# EAGLE design MyMultisensors_rev1 (EAGLE 6.5.0)
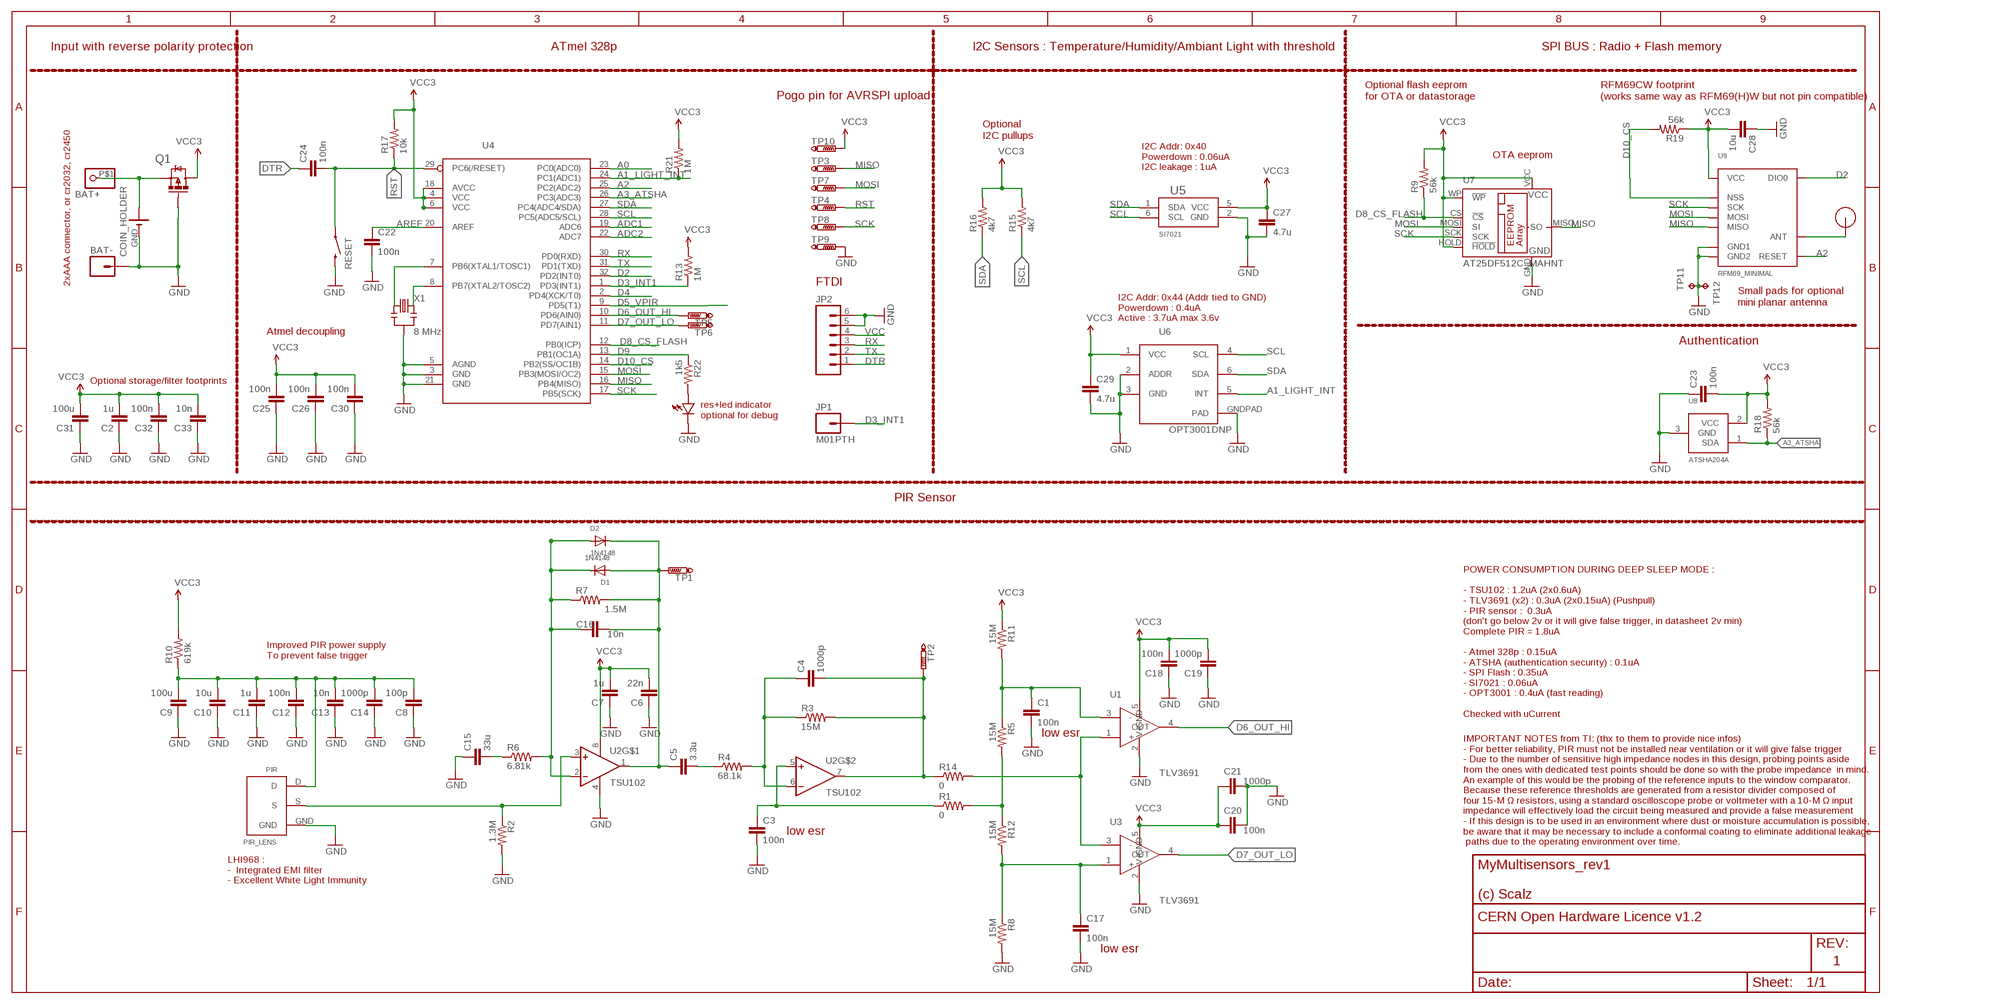
[diagram p0: schematic, sheet 1]

## Parts
ANT  RFM12B_ANTENNA  [RFM12B-ANTENNA]
BAT+  PINHD-1X1TOP  [1X01_ONESIDE]
BAT-  M01PTH  [1X01]
C1  100n  CAP0603-CAP  [0603-CAP]
C2  1u  CAP0805-CAP  [0805-CAP]
C3  100n  CAP0603-CAP  [0603-CAP]
C4  1000p  CAP0603-CAP  [0603-CAP]
C5  3.3u  CAP0603-CAP  [0603-CAP]
C6  22n  CAP0603-CAP  [0603-CAP]
C7  1u  CAP0603-CAP  [0603-CAP]
C8  100p  CAP0603-CAP  [0603-CAP]
C9  100u  CAP0805-CAP  [0805-CAP]
C10  10u  CAP0805-CAP  [0805-CAP]
C11  1u  CAP0603-CAP  [0603-CAP]
C12  100n  CAP0603-CAP  [0603-CAP]
C13  10n  CAP0603-CAP  [0603-CAP]
C14  1000p  CAP0603-CAP  [0603-CAP]
C15  33u  CAP0805-CAP  [0805-CAP]
C16  10n  CAP0603-CAP  [0603-CAP]
C17  100n  CAP0603-CAP  [0603-CAP]
C18  100n  CAP0603-CAP  [0603-CAP]
C19  1000p  CAP0603-CAP  [0603-CAP]
C20  100n  CAP0603-CAP  [0603-CAP]
C21  1000p  CAP0603-CAP  [0603-CAP]
C22  100n  CAP0603-CAP  [0603-CAP]
C23  100n  CAP0603-CAP  [0603-CAP]
C24  100n  CAP0805-CAP  [0805-CAP]
C25  100n  CAP0603-CAP  [0603-CAP]
C26  100n  CAP0603-CAP  [0603-CAP]
C27  4.7u  CAP0603-CAP  [0603-CAP]
C28  10u  CAP0805-CAP  [0805-CAP]
C29  4.7u  CAP0603-CAP  [0603-CAP]
C30  100n  CAP0603-CAP  [0603-CAP]
C31  100u  CAP0805-CAP  [0805-CAP]
C32  100n  CAP0603-CAP  [0603-CAP]
C33  10n  CAP0603-CAP  [0603-CAP]
COIN_HOLDER  CR2450_H_LOWCOSTVERTICAL_WITH_MILL  [CR2450H_LOWCOST2]
D1  1N4148  DIODESOD-123  [SOD-123]
D2  1N4148  DIODESOD-123  [SOD-123]
D3  LED0805  [0805-LED]
JP1  M01PTH  [1X01]
JP2  M06SIP  [1X06]
PIR  PIR_LENS  [PIR_LENS]
Q1  SI2399DS-T1-GE3  [SOT95P237X112-3N]
R1  0  RESISTOR0603-RES  [0603-RES]
R2  1.3M  RESISTOR0603-RES  [0603-RES]
R3  15M  RESISTOR0603-RES  [0603-RES]
R4  68.1k  RESISTOR0603-RES  [0603-RES]
R5  15M  RESISTOR0603-RES  [0603-RES]
R6  6.81k  RESISTOR0603-RES  [0603-RES]
R7  1.5M  RESISTOR0603-RES  [0603-RES]
R8  15M  RESISTOR0603-RES  [0603-RES]
R9  56k  RESISTOR0603-RES  [0603-RES]
R10  619k  RESISTOR0603-RES  [0603-RES]
R11  15M  RESISTOR0603-RES  [0603-RES]
R12  15M  RESISTOR0603-RES  [0603-RES]
R13  1M  RESISTOR0603-RES  [0603-RES]
R14  0  RESISTOR0603-RES  [0603-RES]
R15  4k7  RESISTOR0603-RES  [0603-RES]
R16  4k7  RESISTOR0603-RES  [0603-RES]
R17  10k  RESISTOR0805-RES  [0805-RES]
R18  56k  RESISTOR0603-RES  [0603-RES]
R19  56k  RESISTOR0603-RES  [0603-RES]
R21  1M  RESISTOR0603-RES  [0603-RES]
R22  1k5  RESISTOR0603-RES  [0603-RES]
RESET  SWITCH-MOMENTARY-2-SMD-1101NE  [TACTILE-SWITCH-1101NE]
TP1  PTR1B1,27  [B1,27]
TP2  PTR1B1,27  [B1,27]
TP3  PTR1TP18R  [TP18R]
TP4  PTR1TP18R  [TP18R]
TP5  PTR1B1,27  [B1,27]
TP6  PTR1B1,27  [B1,27]
TP7  PTR1TP18R  [TP18R]
TP8  PTR1TP18R  [TP18R]
TP9  PTR1TP18R  [TP18R]
TP10  PTR1TP18R  [TP18R]
TP11  TPTP10SQ  [TP10SQ]
TP12  TPTP10SQ  [TP10SQ]
U1  TLV3691  [SC70-5]
U2  TSU102  [MINI_SO8]
U3  TLV3691  [SC70-5]
U4  ATMega-328  ATMEGA168/328TQFP32  [TQFP32-08]
U5  SI7021  [DFN6]
U6  OPT3001DNP  [OPT3001DNP]
U7  AT25DF512C_MAHNT  [AT25DF512C_MAHNT]
U8  ATSHA204A  [SOT23]
U9  RFM69_MINIMAL  [RFM69CW_MINIMAL]
X1  8 MHz  RESONATORSMD  [RESONATOR-SMD]

## Nets
A0: U4.23(PC0(ADC0))
A1_LIGHT_INT: R21.1 U4.24(PC1(ADC1)) U6.5(INT)
A2: U4.25(PC2(ADC2)) U9.RESET
A3_ATSHA: R18.1 U4.26(PC3(ADC3)) U8.1(SDA)
ADC1: U4.19(ADC6)
ADC2: U4.22(ADC7)
AREF: C22.1 U4.20(AREF)
D2: U4.32(PD2(INT0)) U9.DIO0
D3_INT1: JP1.1 R13.1 U4.1(PD3(INT1))
D4: U4.2(PD4(XCK/T0))
D5_VPIR: U4.9(PD5(T1))
D6_OUT_HI: TP5.TP U1.4(OUT) U4.10(PD6(AIN0))
D7_OUT_LO: TP6.TP U3.4(OUT) U4.11(PD7(AIN1))
D8_CS_FLASH: R9.1 U4.12(PB0(ICP)) U7.CS(!CS)
D9: R22.1 U4.13(PB1(OC1A))
D10_CS: R19.2 U4.14(PB2(SS/OC1B)) U9.NSS
DTR: C24.1 JP2.1
GND: BAT-.1 C1.2 C2.1 C3.2 C6.1 C7.1 C8.1 C9.1 C10.1 C11.1 C12.1 C13.1 C14.1 C15.1 C17.2 C18.1 C19.1 C20.1 C21.1 C22.2 C23.1 C25.1 C26.1 C27.2 C28.1 C29.2 C30.1 C31.1 C32.1 C33.1 COIN_HOLDER.GND(-) D3.MINUS JP2.5 JP2.6 PIR.GND Q1.1(G) R2.2 R8.2 RESET.P$2 TP9.TP TP11.TP TP12.TP U1.2(GND) U2.4(V-) U3.2(GND) U4.3(GND) U4.5(AGND) U4.21(GND) U5.2(GND) U6.2(ADDR) U6.3(GND) U6.GNDPAD(PAD) U7.GND U8.3(GND) U9.GND2 U9.GND(GND1) X1.2
MISO: TP3.TP U4.16(PB4(MISO)) U7.MISO(SO) U9.MISO
MOSI: TP7.TP U4.15(PB3(MOSI/OC2)) U7.MOSI(SI) U9.MOSI
N$1: C17.1 R8.1 R12.2 U3.1(+)
N$3: PIR.S R2.1 U2.3(+IN)
N$4: D3.PLUS R22.2
N$5: C16.1 D1.C D2.A R6.2 R7.1 U2.2(-IN)
N$6: C15.2 R6.1
N$7: C5.1 C16.2 D1.A D2.C R7.2 TP1.TP U2.1(OUT)
N$8: C5.2 R4.1
N$9: C4.1 R3.1 R4.2 U2.6(-IN)
N$10: C4.2 R3.2 R14.1 TP2.TP U2.7(OUT)
N$11: U4.7(PB6(XTAL1/TOSC1)) X1.1
N$13: C1.1 R5.1 R11.2 U1.3(-)
N$17: C3.1 R1.1 U2.5(+IN)
N$18: C8.2 C9.2 C10.2 C11.2 C12.2 C13.2 C14.2 PIR.D R10.1
N$20: R14.2 U1.1(+) U3.3(-)
N$21: R1.2 R5.2 R12.1
N$22: U4.8(PB7(XTAL2/TOSC2)) X1.3
N$23: ANT.P$1 U9.ANT
N$24: BAT+.P$1 COIN_HOLDER.VBAT@1(+) COIN_HOLDER.VBAT@2(+) COIN_HOLDER.VBAT@3(+) COIN_HOLDER.VBAT@4(+) Q1.2(S)
RST: C24.2 R17.1 RESET.P$1 TP4.TP U4.29(PC6(/RESET))
RX: JP2.3 U4.30(PD0(RXD))
SCK: TP8.TP U4.17(PB5(SCK)) U7.SCK U9.SCK
SCL: R15.1 U4.28(PC5(ADC5/SCL)) U5.6(SCL) U6.4(SCL)
SDA: R16.1 U4.27(PC4(ADC4/SDA)) U5.1(SDA) U6.6(SDA)
TX: JP2.2 U4.31(PD1(TXD))
VCC: C2.2 C6.2 C7.2 C18.2 C19.2 C20.2 C21.2 C23.2 C25.2 C26.2 C27.1 C28.2 C29.1 C30.2 C31.2 C32.2 C33.2 JP2.4 Q1.3(D) R9.2 R10.2 R11.1 R13.2 R15.2 R16.2 R17.2 R18.2 R19.1 R21.2 TP10.TP U1.5(V+) U2.8(V+) U3.5(V+) U4.4(VCC) U4.6(VCC) U4.18(AVCC) U5.5(VCC) U6.1(VCC) U7.HOLD(!HOLD) U7.VCC U7.WP(!WP) U8.2(VCC) U9.VDD(VCC) ; supply symbol labelled VCC3

## Notes on the sheet
- Input with reverse polarity protection | ATmel 328p | I2C Sensors : Temperature/Humidity/Ambiant Light with threshold | SPI BUS : Radio + Flash memory
- Pogo pin for AVRSPI upload
- Optional flash eeprom
  for OTA or datastorage
- RFM69CW footprint 
  (works same way as RFM69(H)W but not pin compatible)
- Optional 
  I2C pullups
- OTA eeprom
- I2C Addr: 0x40
  Powerdown : 0.06uA
  I2C leakage : 1uA
- 2xAAA connector, or cr2032, cr2450 | FTDI
- Small pads for optional
  mini planar antenna
- I2C Addr: 0x44 (Addr tied to GND)
  Powerdown : 0.4uA
  Active : 3.7uA max 3.6v
- Atmel decoupling
- Authentication
- Optional storage/filter footprints
- res+led indicator
  optional for debug
- PIR Sensor
- Improved PIR power supply
  To prevent false trigger
- POWER CONSUMPTION DURING DEEP SLEEP MODE :
  
  - TSU102 : 1.2uA (2x0.6uA)
  - TLV3691 (x2) : 0.3uA (2x0.15uA) (Pushpull)
  - PIR sensor :  0.3uA
  (don't go below 2v or it will give false trigger, in datasheet 2v min) 
  Complete PIR = 1.8uA 
  
  - Atmel 328p : 0.15uA
  - ATSHA (authentication security) : 0.1uA
  - SPI Flash : 0.35uA
  - SI7021 : 0.06uA
  - OPT3001 : 0.4uA (fast reading)
  
  Checked with uCurrent
- low esr
- low esr
- IMPORTANT NOTES from TI: (thx to them to provide nice infos)
  - For better reliability, PIR must not be installed near ventilation or it will give false trigger
  - Due to the number of sensitive high impedance nodes in this design, probing points aside 
  from the ones with dedicated test points should be done so with the probe impedance  in mind. 
  An example of this would be the probing of the reference inputs to the window comparator. 
  Because these reference thresholds are generated from a resistor divider composed of 
  four 15-M Ω resistors, using a standard oscilloscope probe or voltmeter with a 10-M Ω input 
  impedance will effectively load the circuit being measured and provide a false measurement
  - If this design is to be used in an environment where dust or moisture accumulation is possible,
  be aware that it may be necessary to include a conformal coating to eliminate additional leakage 
   paths due to the operating environment over time.
- LHI968 :
  -  Integrated EMI filter
  - Excellent White Light Immunity
- low esr

## Library data of the parts
ANT = LowPowerLab:RFM12B_ANTENNA
BAT+ = Multisensors_lib:PINHD-1X1: Pin header 1x1 for 0.1" spacing With round pins
BAT- JP1 = SparkFun-Connectors:M01: Header 1 Standard 1-pin 0.1" header. Use with straight break away headers (SKU : PRT-00116), right angle break away headers (PRT-00553), swiss pins (PRT-00743), machine pins (PRT-00117), and female headers (PRT-00115).
C1-C33 = LowPowerLab:CAP: Capacitor Standard 0603 ceramic capacitor, and 0.1" leaded capacitor.
COIN_HOLDER = Multisensors_lib:CR2450_H_LOWCOST
D1 D2 = adafruit:DIODE: Diode SMADIODE - SMA Surface Mount Package 20V 1A Schottky Diode Digikey: 641-1014-6-ND DO-1N4148 - Through Hole Small Current Diode SOD-123 20V 1 A (.5mV Vf) Schottky Diode - Digikey: MBRX120TPMSCT-ND SOD-323 10V 570mA (.38mV Vf, 3ns) Schottky Diode - Digikey: ZLLS410CT-ND SOD-523 30V 30mA Schottky Diode (RB751S-40TE61) - Digikey: RB751S-40TE61CT-ND SOT23-R/W - SOT23 Package (R = Solder Paste/Reflow Ovens, W = Hand-Soldering) BAT54Film 40V 300mA - Digikey: 497-7162-1-ND
D3 = LowPowerLab:LED
JP2 = SparkFun-Connectors:M06: Header 6 Standard 6-pin 0.1" header. Use with straight break away headers (SKU : PRT-00116), right angle break away headers (PRT-00553), swiss pins (PRT-00743), machine pins (PRT-00117), and female headers (PRT-00115). Molex polarized connector foot print use with SKU : PRT-08094 with associated crimp pins and housings. NOTES ON THE VARIANTS LOCK and LOCK_LONGPADS... This footprint was designed to help hold the alignment of a through-hole component (i.e. 6-pin header) while soldering it into place. You may notice that each hole has been shifted either up or down by 0.005 of an inch from it's more standard position (which is a perfectly straight line). This slight alteration caused the pins (the squares in the middle) to touch the edges of the holes. Because they are alternating, it causes a "brace" to hold the component in place. 0.005 has proven to be the perfect amount of "off-center" position when using our standard breakaway headers. Although looks a little odd when you look at the bare footprint, once you have a header in there, the alteration is very hard to notice. Also,if you push a header all the way into place, it is covered up entirely on the bottom side. This idea of altering the position of holes to aid alignment will be further integrated into the Sparkfun Library for other footprints. It can help hold any component with 3 or more connection pins.
PIR = Multisensors_lib:PIR_LENS
Q1 = Multisensors_lib:SI2399DS-T1-GE3: P-Channel 20-V (D-S) MOSFET; MPN: SI2399DS-T1-GE3; OC_FARNELL: 2056681; OC_NEWARK: 64T4058; PACKAGE: SOT-23-3; SUPPLIER: VISHAY SILICONIX
R1-R19 R21 R22 = LowPowerLab:RESISTOR: Resistor Basic schematic elements and footprints for 0603, 1206, and PTH resistors.
RESET = SparkFun:SWITCH-MOMENTARY-2
TP1-TP10 = testpad:PTR1: TEST PIN
TP11 TP12 = testpad:TP: Test pad
U1 U3 = Multisensors_lib:TLV3691
U2 = Multisensors_lib:TSU102
U4 = LowPowerLab:ATMEGA168/328: Atmel 32-pin 8-bit micro, 16k flash.
U5 = Multisensors_lib:SI7021
U6 = Multisensors_lib:OPT3001DNP
U7 = Multisensors_lib:AT25DF512C_MAHNT
U8 = Multisensors_lib:ATSHA204A
U9 = Multisensors_lib:RFM69_MINIMAL
X1 = SparkFun:RESONATOR: Resonator Small SMD resonator. This is the itty bitty 10/20MHz resonators with built in caps. CSTCE10M0G55 and CSTCE20M0V53. Footprint has been reviewed closely but hasn't been tested yet.

## Net classes
0 default: width 0.203 mm, clearance 0.203 mm

## Board
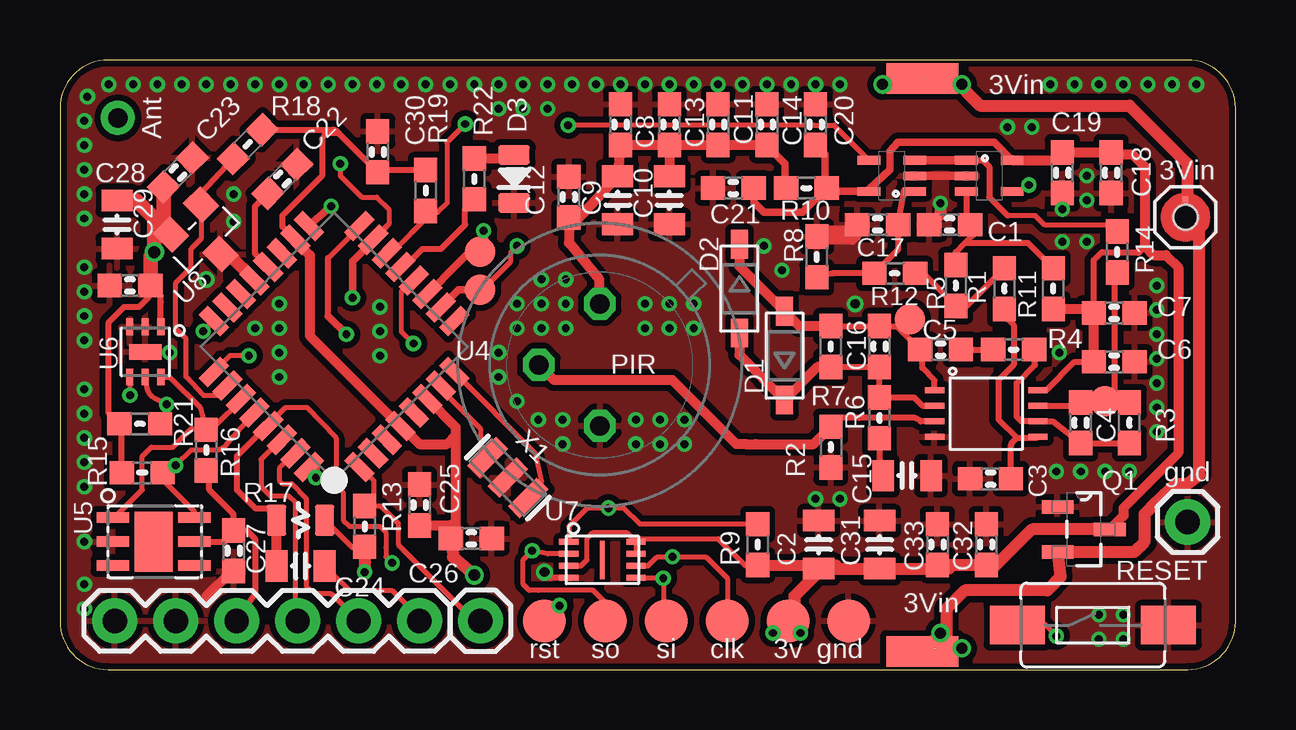
[diagram p1: board, top side]
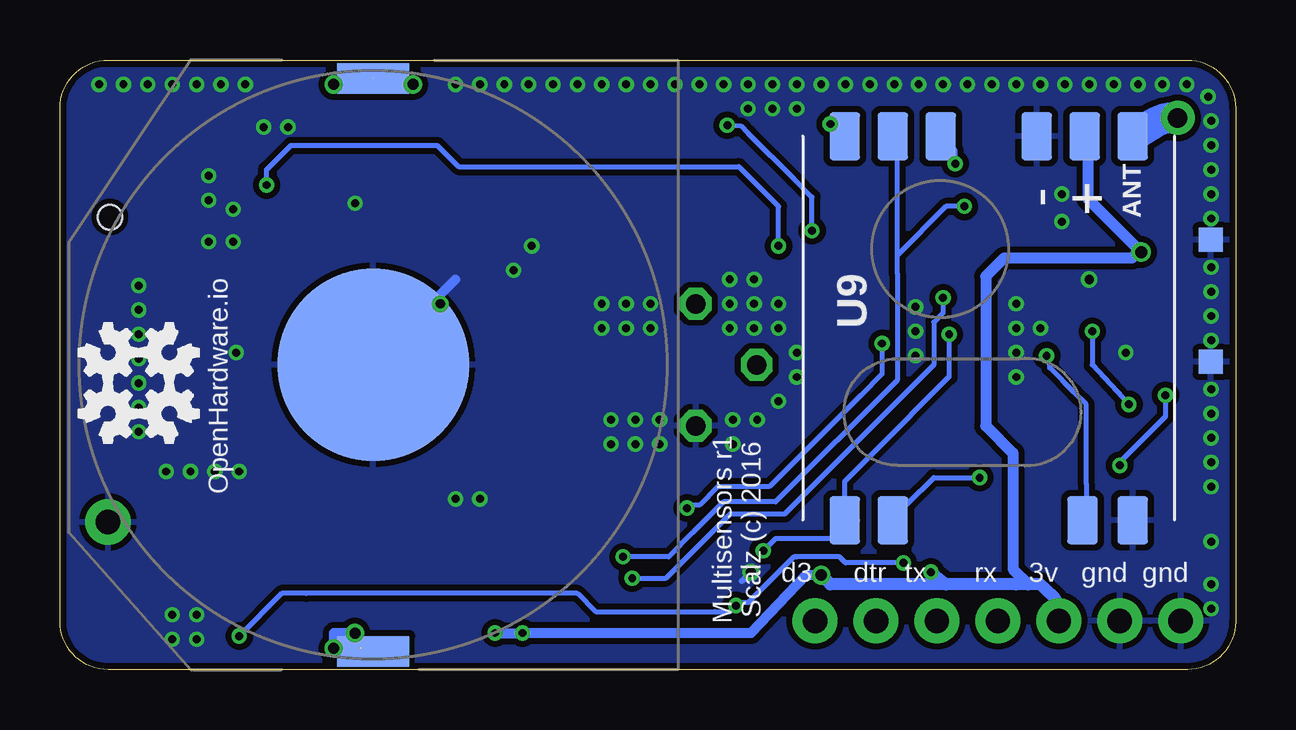
[diagram p2: board, bottom side, seen from below]

Size 49 x 25.4 mm. Coordinates in mm from the lower left corner, seen from the top.
Outline: 0,23.4 0,2 arc90 2,0 34.54,0 37.59,0 47,0 arc90 49,2 49,23.4 arc90 47,25.4 37.47,25.4 34.42,25.4 2,25.4 arc90 0,23.4
Copper layers (1*16): Top 0.035mm / dielectric 1.5mm / Bottom 0.035mm
Design rules "SeeedStudio_2layer_DRU_no_angle_20140221": minimum track width 6mil, minimum drill 12mil, track to track 6mil, track to pad 6mil, pad to pad 6mil, via to via 6mil, smd to smd 0mil, copper to edge 10mil, drill to drill 10mil, minimum pad ring 10mil, minimum via ring 6mil, stop-mask expansion 2mil, vias tented up to drill 100mil, thermal gap 10mil

### Footprints (pad centres in the part's own frame; a part is rotated, then mirrored left to right if it is on the bottom)
RFM12B-ANTENNA = drill 0.8 pad 1.422: P$1 0,0
1X01_ONESIDE = smd 0.254 x 0.254: P$1 0,0.737 | hole 1.016: 0,0
1X01 = drill 1.016 pad 1.88: 1 0,0
0603-CAP = smd 1.016 x 0.965: 1 -0.85,0; 2 0.85,0
0805-CAP = smd 0.902 x 1.3: 1 -1,0; 2 1,0
CR2450H_LOWCOST2 = smd 8 x 8: GND 0,0 | smd 1.27 x 3: VBAT@1 -11.938,0; VBAT@2 11.938,0 | smd 1.27 x 3 bottom: VBAT@3 -11.938,0; VBAT@4 11.938,0
SOD-123 = smd 1.2 x 0.7: A 1.85,0; C -1.85,0
0805-LED = smd 0.8 x 1.3: MINUS -1,0; PLUS 1,0
1X06 = drill 1.016 pad 1.88: 1 0,0; 2 2.54,0; 3 5.08,0; 4 7.62,0; 5 10.16,0; 6 12.7,0
PIR_LENS = drill 0.813 octagon: D 0,2.54; GND 0,-2.54; S -2.54,0
SOT95P237X112-3N = smd 1.321 x 0.559: 1 -1.092,0.94; 2 -1.092,-0.94; 3 1.092,0
0603-RES = smd 1.016 x 0.965: 1 -0.85,0; 2 0.85,0
0805-RES = smd 0.8 x 1.3: 1 -1,0; 2 1,0
TACTILE-SWITCH-1101NE = smd 2.3 x 1.6: P$1 -3.15,0; P$2 3.15,0
B1,27 = smd 1.27 x 1.27: TP 0,0
TP18R = smd 1.8 x 1.8: TP 0,0
TP10SQ = smd 1 x 1: TP 0,0
SC70-5 = smd 0.36 x 0.95: 1 -0.65,-0.95; 2 0,-0.95; 3 0.65,-0.95; 4 0.65,0.95; 5 -0.65,0.95
MINI_SO8 = smd 0.25 x 0.8: 1 -0.975,-2.15; 2 -0.325,-2.15; 3 0.325,-2.15; 4 0.975,-2.15; 5 0.975,2.15; 6 0.325,2.15; 7 -0.325,2.15; 8 -0.975,2.15
TQFP32-08 = smd 1.27 x 0.533: 1 -4.293,2.8; 2 -4.293,2; 3 -4.293,1.2; 4 -4.293,0.4; 5 -4.293,-0.4; 6 -4.293,-1.2; 7 -4.293,-2; 8 -4.293,-2.8; 17 4.293,-2.8; 18 4.293,-2; 19 4.293,-1.2; 20 4.293,-0.4; 21 4.293,0.4; 22 4.293,1.2; 23 4.293,2; 24 4.293,2.8 | smd 0.533 x 1.27: 9 -2.8,-4.293; 10 -2,-4.293; 11 -1.2,-4.293; 12 -0.4,-4.293; 13 0.4,-4.293; 14 1.2,-4.293; 15 2,-4.293; 16 2.8,-4.293; 25 2.8,4.293; 26 2,4.293; 27 1.2,4.293; 28 0.4,4.293; 29 -0.4,4.293; 30 -1.2,4.293; 31 -2,4.293; 32 -2.8,4.293
DFN6 = smd 1.35 x 0.45: 1 -1.7,1; 2 -1.7,0; 3 -1.7,-1; 4 1.7,-1; 5 1.7,0; 6 1.7,1 | smd 1.6 x 2.5: P$1 0,0
OPT3001DNP = smd 0.7 x 0.3: 1 -1.05,0.65; 2 -1.05,0; 3 -1.05,-0.65; 4 1.05,-0.65; 5 1.05,0; 6 1.05,0.65 | smd 0.65 x 1.35: GNDPAD 0,0
AT25DF512C_MAHNT = smd 0.25 x 0.8: CS -0.75,-1.4; GND 0.75,-1.4; HOLD -0.25,1.4; MISO -0.25,-1.4; MOSI 0.75,1.4; SCK 0.25,1.4; VCC -0.75,1.4; WP 0.25,-1.4 | smd 1.6 x 0.2: P$9 0,0
SOT23 = smd 1.016 x 1.143: 1 -0.889,-1.016; 2 0.889,-1.016; 3 0,1.016
RFM69CW_MINIMAL = smd 2 x 1.27: ANT 8,-6; DIO0 -8,4; GND 8,-2; GND2 -8.002,-6; MISO -8,6; MOSI 8,2; NSS 8,6; RESET -8.002,-3.905; SCK 8,4; VDD 8,-4
RESONATOR-SMD = smd 0.7 x 1.7: 1 -1.2,0; 2 0,0; 3 1.2,0

### Placement (x,y rotation side)
ANT  2.41,22.99 0 top
BAT+  46.91,18.85 0 top
BAT-  47,6.15 0 top
C1  37.08,18.54 180 top
C2  31.62,5.21 270 top
C3  38.79,7.95 180 top
C4  42.55,10.29 90 top
C5  36.7,13.34 0 top
C6  43.94,12.83 180 top
C7  43.94,14.86 180 top
C8  23.37,22.71 270 top
C9  23.24,19.56 90 top
C10  25.4,19.56 90 top
C11  27.43,22.71 270 top
C12  21.21,19.68 270 top
C13  25.4,22.71 270 top
C14  29.46,22.71 270 top
C15  35.31,8.08 180 top
C16  34.16,13.46 90 top
C17  34.09,18.54 180 top
C18  43.81,20.7 90 top
C19  41.78,20.7 90 top
C20  31.5,22.71 270 top
C21  28.07,20.07 0 top
C22  9.27,20.45 45 top
C23  4.92,20.72 225 top
C24  10.03,4.32 180 top
C25  14.99,6.86 270 top
C26  17.14,5.46 180 top
C27  7.24,4.95 270 top
C28  2.38,18.54 90 top
C29  2.92,16 180 top
C30  13.25,21.57 270 top
C31  34.16,5.21 270 top
C32  38.61,5.21 270 top
C33  36.58,5.21 270 top
COIN_HOLDER  35.94,12.7 270 bottom
D1  30.2,13.08 90 top
D2  28.32,15.88 270 top
D3  18.92,20.45 90 top
JP1  17.53,2.03 0 top
JP2  14.99,2.03 180 top
PIR  22.5,12.7 0 top
Q1  42.67,5.84 0 top
R1  39.37,15.88 90 top
R2  32.13,9.27 270 top
R3  44.58,10.29 90 top
R4  39.75,13.34 0 top
R5  37.34,16 270 top
R6  34.16,10.49 90 top
R7  32.13,13.46 90 top
R8  31.55,17.2 90 top
R9  29.08,5.21 270 top
R10  31.11,20.07 0 top
R11  41.4,15.88 90 top
R12  34.8,16.51 180 top
R13  12.7,5.97 270 top
R14  44.07,17.4 90 top
R15  3.43,8.2 180 top
R16  6.1,9.14 270 top
R17  10.03,6.22 0 top
R18  7.82,21.89 45 top
R19  15.24,19.96 270 top
R21  3.33,10.24 180 top
R22  17.27,20.45 90 top
RESET  43.05,1.85 0 top
TP1  35.43,14.61 0 top
TP2  43.56,11.18 0 top
TP3  22.73,2.03 90 top
TP4  20.19,2.03 90 top
TP5  17.5,15.82 0 top
TP6  17.5,17.42 0 top
TP7  25.27,2.03 90 top
TP8  27.81,2.03 90 top
TP9  32.87,2.03 90 top
TP10  30.35,2.03 90 top
TP11  1.04,17.91 0 bottom
TP12  1.04,12.83 0 bottom
U1  38.73,20.57 270 top
U2  38.61,10.67 270 top
U3  34.67,20.57 90 top
U4  11.43,13.46 135 top
U5  3.9,5.33 0 top
U6  3.56,13.24 270 top
U7  22.61,4.57 270 top
U8  5.97,18.03 225 top
U9  10.29,14.22 90 bottom
U$6  [OPENHW_IO_SMALL]  48.26,14.48 270 bottom
X1  18.67,8 315 top

### Tracks (layer width: path | path; a pad name or v marks a point on that pad's centre or on a via)
A1_LIGHT_INT  (via drill 0.33 pad 0.64)
  Top 0.203: U6.5 3.63,11.75 arc54 3.97,11.29 v4.45,11.05 4.19,10.13 R21.1 | U4.24 6.39,14.52 v5.97,14.1
  Bottom 0.203: v5.97,14.1 5.97,12.7 v4.45,11.05
A2  (via drill 0.33)
  Top 0.203: v7.87,13.08 7.09,13.08 U4.25
  Bottom 0.203: 6.73,11.56 6.22,11.05 6.22,7.75 6.22,6.38 U9.RESET 6.25,6.64 | 6.73,11.56 7.11,11.94 | v7.87,13.08 7.75,12.57 6.73,11.56
A3_ATSHA
  Top 0.203: U8.1 5.88,17.94 5.59,17.65 5.46,17.53 5.46,16.76 4.83,16.13 4.83,14.22 5.26,13.79 5.26,12.19 5.97,11.43 6.57,11.43 U4.26
  Top 0.254: R18.1 5.88,19.85 U8.1
AREF
  Top 0.254: U4.20 8.13,17.33 8.13,19.3 C22.1
D2  (via drill 0.33 pad 0.64)
  Top 0.305: v10.67,8 10.67,8.74 U4.32
  Bottom 0.203: v10.67,8 12.57,8 13.65,6.92 U9.DIO0
D3_INT1
  Top 0.203: U4.1 12.51,8.45 13.08,7.87 13.08,6.82 | 13.08,6.82 R13.1 | 13.08,6.82 13.37,6.82 14.1,6.1 14.1,5.21 16.76,2.54 17.02,2.54 JP1.1
D6_OUT_HI  (via drill 0.33, 0.33 pad 0.64)
  Top 0.203: 17.56,15.88 17.65,15.88 18.8,17.02 18.8,17.4 v19.05,17.65 | U1.4 39.99,19.92 v40.39,20.19
  Top 0.254: 17.56,15.88 TP5.TP
  Top 0.305: U4.10 16.62,15.82 TP5.TP
  Bottom 0.203: v40.39,20.19 40.39,20.83 39.37,21.84 33.27,21.84 32.38,20.95 20.7,20.95 19.94,20.19 19.05,19.3 v19.05,17.65
D7_OUT_LO  (via drill 0.33 pad 0.64)
  Top 0.203: 33.51,21.22 U3.4 32.26,22.68 31.42,22.68 v21.18,22.68
  Top 0.254: 17.19,17.53 16.6,16.93
  Top 0.305: U4.11 16.6,16.93 17.08,17.42
  Top 0.406: 17.19,17.53 17.5,17.53 TP6.TP 17.65,17.92 v17.65,18.29
  Bottom 0.203: v17.65,18.29 17.65,19.68 18.41,20.45 20.32,22.35 20.62,22.66 v21.18,22.68
D8_CS_FLASH  (via drill 0.33 pad 0.64)
  Top 0.203: U4.12 14.69,16.21 14.22,15.75 14.22,14.1 v14.73,13.59 | 21.45,5.32 U7.CS 21.21,5.52 21.21,5.97 21.97,6.73 v22.86,6.73 23.5,6.73 24.17,6.06 R9.1
  Bottom 0.203: v22.86,6.73 22.73,6.86 22.35,6.86 21.59,7.62 19.94,7.62 19.43,7.62 15.62,11.43 14.73,12.32 v14.73,13.59
D9
  Top 0.254: U4.13 14.37,16.78 15.11,17.53 15.88,17.53 16.89,18.54 16.89,19.22 R22.1
D10_CS  (via drill 0.33 pad 0.64)
  Top 0.203: U4.14 13.79,17.35 14.61,18.16 15.3,18.86 15.3,19.05 | v16.89,22.73 16.13,21.97 16.13,19.43 15.75,19.05 15.3,19.05 | 15.3,19.05 R19.2
  Bottom 0.254: U9.NSS 16.25,22.22 v16.89,22.73
DTR
  Top 0.203: C24.1 11.18,4.19 12.06,3.3 13.84,3.3 14.99,2.16 JP2.1
GND  (via drill 0.33 pad 0.64, 0.38 pad 0.64, 0.41)
  Top 0.254: U7.GND 20.46,3.82 v20.19,4.06
  Top 0.356: 35.69,20.57 37.72,20.57
  Top 0.406: C27.2 7.15,4.1 6.1,3.05 | C17.2 33.24,18.12 33.02,17.91 31.69,17.91 R8.2 | 33.15,18.29 31.81,18.29
  Top 0.508: U4.21 7.01,17.32 U8.3 | v36.7,19.43 36.7,18.96 C1.2
  Bottom 0.254: v20.19,4.06 20.57,3.68
  Bottom 0.406: v33.15,15.24 33.15,15.62 32.51,16.26
  other vias: 13.34,15.11 1.14,23.88 1.02,22.86 1.02,21.84 1.02,3.56 1.02,2.54 1.02,20.83 1.02,19.81 1.02,18.8 1.02,16.76 13.34,14.1 13.34,13.08 1.02,15.75 1.02,14.73 1.02,13.72 4.06,24.38 5.08,24.38 6.1,24.38 7.11,24.38 8.13,24.38 9.14,24.38 10.16,24.38 11.18,24.38 12.19,24.38 13.21,24.38 14.22,24.38 15.24,24.38 16.26,24.38 3.05,24.38 2.03,24.38 9.14,15.24 9.14,14.22 9.14,13.21 8.13,14.22 1.02,11.68 1.02,10.67 1.02,9.65 1.02,8.64 1.02,7.62 1.02,5.33 19.05,15.24 20.07,15.24 18.29,12.19 7.24,19.81 7.24,18.67 19.05,11.18 19.94,10.41 42.8,17.83 30.1,16.64 29.34,17.65 41.66,13.21 32.51,7.11 31.5,7.11 19.05,14.22 20.07,14.22 21.08,14.22 21.08,15.24 20.95,10.41 25.02,10.41 24,10.41 24.38,14.22 25.4,14.22 26.42,14.22 24,9.4 25.02,9.4 26.04,9.4 26.04,10.41 24.38,15.24 25.4,15.24 26.42,15.24 18.29,13.21 39.5,22.61 40.51,22.61 42.8,20.57 42.8,19.56 41.78,17.83 45.72,16 17.27,24.38 18.29,24.38 19.3,24.38 20.32,24.38 21.34,24.38 41.78,19.18 47.37,24.38 46.35,24.38 45.34,24.38 44.32,24.38 43.31,24.38 42.29,24.38 41.27,24.38 22.35,24.38 23.37,24.38 24.38,24.38 25.4,24.38 26.42,24.38 27.43,24.38 28.45,24.38 29.46,24.38 30.48,24.38 31.5,24.38 32.51,24.38 45.72,14.99 45.72,13.97 45.72,12.95 45.72,11.94 45.72,10.92 45.72,9.91 44.58,8.26 43.56,8.26 42.55,8.26 41.53,8.26 44.32,2.29 44.32,1.27 43.31,1.27 43.31,2.29 18.29,23.37 19.3,23.37 20.32,23.37 20.07,16.26 21.08,16.26 20.95,9.4 9.14,12.19 6.1,16.26 4.57,13.21
  pour Top (isolate 0.254): 0,25.4 49.02,25.4 49.02,0 0,0
  pour Bottom (isolate 0.254): 0,25.4 49.02,25.4 49.02,0 0,0
MISO  (via drill 0.33 pad 0.64)
  Top 0.203: 12.06,18.03 11.18,17.14 | 20.96,4.83 20.96,4.82 20.32,4.82 v19.68,4.95 19.3,4.57 19.3,3.56 19.56,3.3 19.94,3.3 22.23,3.3 22.73,2.79 TP3.TP
  Top 0.254: 12.19,18.29 12.06,18.16 12.06,18.03 | 11.18,14.73 11.18,17.14 | U7.MISO 20.96,4.82
  Top 0.305: U4.16 12.38,18.48 12.06,18.16 | 11.18,14.73 v11.94,13.97
  Bottom 0.203: v11.94,13.97 11.94,12.19 15.11,9.02 16.29,7.84 U9.MISO 15.75,6.22 16.51,5.46 19.18,5.46 v19.68,4.95
MOSI  (via drill 0.33 pad 0.64)
  Top 0.203: v11.68,21.08 11.68,20.57 12.57,19.68 13.21,19.68 13.72,19.18 13.72,18.58 13.59,18.45 | U7.MOSI 23.82,3.81 v25.15,3.81 25.15,2.67 TP7.TP
  Top 0.254: 13.59,18.45 U4.15
  Top 0.305: U4.15 13.05,17.88 12.19,17.02 v12.19,15.49
  Bottom 0.203: v12.19,15.49 12.19,14.86 12.57,14.48 12.57,12.7 18.8,6.48 21.08,6.48 22.35,5.21 23.37,4.19 23.75,3.81 v25.15,3.81 | v11.68,21.08 11.68,21.62 U9.MOSI
N$1
  Top 0.254: R8.1 32.22,16.51 R12.2 34.94,17.5 C17.1 35.19,19.97 U3.1
N$3
  Top 0.254: U2.3 35.88,10.34 35.64,10.49 33.31,10.49 32.5,10.49 R2.1
  Top 0.406: R2.1 31.41,9.4 29,9.4 28.57,9.4 28.19,9.4 25.53,12.06 20.59,12.06 PIR.S
N$4
  Top 0.406: R22.2 18.92,21.3 D3.PLUS
N$5
  Top 0.254: U2.2 35.94,11 35.6,11.34 R6.2 C16.1 R7.1
  Top 0.406: R7.1 31.58,12.61 D1.C 28.32,13.11 D2.A
N$6
  Top 0.254: R6.1 34.16,8.8 C15.2
N$7
  Top 0.254: 35.13,14.05 34.88,14.31 C16.2 R7.2 | 35.13,14.05 C5.1 35.94,13.25 35.94,12.57 36.46,12.06 U2.1 | TP1.TP 35.43,14.35 35.13,14.05
  Top 0.406: D2.C 28.32,16.81 D1.A 30.82,14.31 R7.2
N$8
  Top 0.254: C5.2 R4.1
N$9
  Top 0.254: R3.1 C4.1 41.38,10.34 U2.6 40.08,10.34 39.88,10.54 39.88,11.94 40.64,12.7 40.64,13.3 R4.2
N$10
  Top 0.203: 43.94,16.38 43.85,16.38 R14.1
  Top 0.254: U2.7 42.15,10.99 C4.2 43.52,10.88 TP2.TP | TP2.TP 44.54,10.92 R3.2 | 43.94,16.38 43.94,11.3 TP2.TP
N$11
  Top 0.203: U4.7 15.88,11.68 17.53,10.03 17.53,8.07 X1.1
N$13
  Top 0.254: R5.1 37.34,17.4 37.72,17.78 | 37.72,17.78 40.35,17.78 R11.2 | C1.1 38.19,18.25 37.72,17.78 | C1.1 38.19,18.76 | U1.3 37.78,18.69 C1.1
N$17
  Top 0.254: R1.1 39.37,14.73 39.75,14.35 39.75,12.7 39.12,12.06 39.12,10.41 39.88,9.65 | 39.88,9.65 40.72,9.65 U2.5 | C3.1 39.64,9.3 arc-45 39.71,9.48 39.88,9.65
N$18
  Top 0.305: C14.2 29.46,21.84 30.23,21.08 30.23,20.11 R10.1
  Top 0.406: C14.2 C11.2 C13.2 | C13.2 C8.2 C9.2 21.52,18.71 C12.2 21.21,17.78 22.48,16.26 22.48,14.81 PIR.D | C13.2 C10.2
N$20
  Top 0.203: 39.5,18.92 40.64,18.92 41.02,18.54 43.65,18.54 R14.2
  Top 0.254: U1.1 38.47,21.22 38.73,20.95 38.73,19.68 39.5,18.92
  Top 0.356: U3.3 U1.1
N$21
  Top 0.254: R1.2 37.8,15.15 R5.2 35.98,16.51 R12.1
N$22
  Top 0.203: U4.8 16.45,12.38 19.81,9.02 20.07,7.8 X1.3
N$23
  Bottom 1.27: U9.ANT 3.4,22.75 arc45 ANT.P$1
N$24  (via drill 0.46)  (2 unrouted)
  Top 0.254: 36.96,0.89 36.51,0.89 36.51,1.04
  Top 0.406: v36.7,1.52 36.32,1.14 COIN_HOLDER.VBAT@4 37.59,0.76 v37.59,0.89
  Top 0.508: COIN_HOLDER.VBAT@3 37.21,24.64 38.35,23.5 44.58,23.5 46.99,21.08 46.99,18.86 BAT+.P$1 47.5,18.48 47.5,8.13 46.99,7.75 46.48,7.75 45.72,6.99 45.21,6.48 45.21,5.33 44.78,4.9 Q1.2 41.71,3.86 41.15,3.3 37.72,3.3 36.96,2.54 36.96,0.89 | v34.29,24.38 35.69,24.38 COIN_HOLDER.VBAT@3 | v37.59,24.38 36.2,24.38 COIN_HOLDER.VBAT@3 | 36.37,1.19 36.32,1.14
  Bottom 0.254: 35.94,0.89 36.83,0.89 35.94,0.89 | 35.94,0.89 COIN_HOLDER.VBAT@4 35.94,0.89
  Bottom 0.406: v37.59,0.89 36.83,0.89 | 36.83,0.89 36.45,0.89 | 36.45,0.89 v36.7,1.52 37.59,1.52 37.59,1.02 | 36.45,0.89 36.83,0.89 | 36.83,0.89 36.96,1.02
RST  (via drill 0.33, 0.33 pad 0.64)
  Top 0.203: U4.29 8.62,10.14 9.4,10.92 10.29,10.92 11.51,9.65 11.51,7.87 11.68,7.62 11.81,7.37 11.81,6.22 12.06,5.97 13.34,5.97 13.59,5.71 13.59,5.08 13.59,4.7 v13.84,4.45 | RESET.P$1 41.02,1.91 v41.53,1.4 | 20.19,2.41 TP4.TP v20.83,2.67
  Top 0.254: R17.1 8.65,6.73 8.13,6.73 7.37,7.49 7.37,8.89 8.62,10.14
  Top 0.406: C24.2 R17.1
  Bottom 0.203: v13.84,4.45 16.26,4.45 16.51,4.7 18.29,4.7 18.41,4.7 18.92,4.19 19.18,3.94 20.32,2.79 20.7,2.79 v20.83,2.67 21.08,2.41 21.72,2.41 26.67,2.41 27.43,3.17 28.45,3.17 38.73,3.17 39.75,3.17 v41.53,1.4
RX
  Top 0.203: U4.30 9.2,9.58 8.38,8.76 8.38,7.62 8.76,7.24 9.53,7.24 9.8,6.99 9.8,2.79 9.8,2.13 JP2.3
SCK  (via drill 0.33 pad 0.64)
  Top 0.203: U7.SCK 24.26,4.32 24.51,4.32 24.89,4.7 v25.53,4.7 26.92,4.7 27.81,3.81 TP8.TP
  Top 0.305: U4.17 10.38,18.5 v11.3,19.3
  Bottom 0.203: v25.53,4.7 23.62,4.7 22.61,5.71 21.34,6.99 19.18,6.99 14.1,12.06 14.1,12.95 14.1,16.51 14.1,17.27 | 14.1,17.27 14.1,22.03 U9.SCK | v11.3,19.3 12.06,19.3 14.1,17.27
SCL  (via drill 0.33, 0.33 pad 0.64)
  Top 0.203: 7.92,10.71 U4.28 7.05,9.52 arc-53 6.54,9.14 5.59,9.14 5.46,9.14 v4.83,8.51 4.52,8.2 R15.1 | 4.06,8.38 4.06,8.29 R15.1 | U5.6 5.61,6.59 5.33,6.86 4.15,8.04 R15.1 | U6.4 2.91,11.45 v2.92,11.43
  Bottom 0.203: v2.92,11.43 2.92,10.54 3.68,9.78 | 3.68,9.78 3.81,9.65 | v4.83,8.51 4.83,8.64 3.68,9.78
SDA
  Top 0.203: R16.1 5.84,10.92 4.57,12.19 U6.6 4.21,12.43 | U4.27 7.55,11.23 6.48,10.16 6.01,10.16 R16.1 | U5.1 2.27,6.33 3.43,7.49 3.43,8.89 3.81,9.27 4.7,9.27 5.46,10.03 5.93,10.03 R16.1
TX
  Top 0.203: U4.31 9.77,9.01 9.14,8.38 9.14,7.87 9.27,7.75 9.65,7.75 10.26,7.11 10.26,3.57 arc58 10.38,3.35 10.61,3.21 arc32 10.74,3.17 11.2,3.17 arc-45 11.38,3.1 12.19,2.29 12.32,2.16 JP2.2
VCC  (via drill 0.33 pad 0.64, 0.48 pad 0.64, 0.5)
  Top 0.203: 13.33,20.81 C30.2 | R17.2 11.05,6.22 12.19,5.08 12.66,5.08 R13.2 | U7.VCC U7.HOLD | v29.72,1.52 29.84,2.54 29.91,2.48 TP10.TP | U7.WP 21.72,4.32 21.97,4.57 21.97,5.46 22.23,5.71 22.6,5.71 23.61,5.71 U7.VCC | 2.46,10.24 R21.2 2.58,10.14 | 3.68,15.91 C29.1 | U7.VCC 24.01,5.34 24.13,5.46 27.43,5.46 28.57,4.32 29.68,4.32 R9.2 | U2.8 41.11,11.64
  Top 0.254: C27.1 7.79,5.8 8.13,5.46 8.13,3.17 JP2.4 | U5.5 6.9,5.33 C27.1 | U6.1 4.21,15.31 4.21,15.57 C29.1 | U4.18 9.27,18.45 9.27,18.92 10.92,20.57 10.92,22.1 11.05,22.35 11.62,22.35 11.9,22.07 | C30.2 11.9,22.07 | R19.1 13.33,20.81 | R18.2 11.37,22.5 arc-45 11.55,22.42 11.9,22.07 | C27.1 7.24,6.48 6.22,7.49 6.22,8.17 R16.2 | 2.46,10.24 2.03,10.67 2.03,14.48 2.67,15.11 3.3,15.11 3.68,15.49 3.68,15.91 | R15.2 2.58,10.14 | 41.11,11.64 42.29,12.83 C6.2 | C7.2 43.09,17.06 43.43,17.4 44.96,17.4
  Top 0.305: C20.2 31.58,21.76 31.88,21.46 31.88,20.15 R10.2 | C21.2 28.92,19.47 29.34,19.05 30.95,19.05 R10.2 | R10.2 32.11,19.92 U3.5 33.72,20 34.59,20.83 34.59,21.59 34.92,21.97 38.94,21.97 U1.5 | 44.96,17.4 45.21,17.65
  Top 0.406: U4.18 9.81,17.88 10.41,17.27 10.41,13.91 U4.4 14.24,10.14 14.99,9.4 16.13,9.4 16.51,9.78 | 16.51,9.78 16.51,8.64 16.51,5.84 16.42,5.55 C26.2 16.33,6.01 C25.2 | 16.51,9.78 16.51,10.08 U4.6 | 30.1,2.29 TP10.TP | 42.93,12.83 C6.2 C7.2 42.93,15.03 R11.1 | U1.5 41.46,21.22 C19.2 C18.2 | 43.9,21.46 44.7,21.46 45.21,20.95 45.21,17.65 45.59,17.27 46.1,17.27 46.61,16.76 46.61,9.02 44.32,6.73 44.32,6.4 Q1.3
  Top 0.457: R9.2 32.36,4.36 C2.2
  Top 0.508: 16.33,6.01 16.33,5.38 16.38,4.7 v17.27,3.94 | R13.2 v12.7,4.06 | 30.35,2.16 TP10.TP 30.61,2.29 30.61,3.05 31.77,4.21 C2.2 C31.2 37.06,4.21 C33.2 C32.2 38.95,4.32 38.99,4.32 40.51,5.84 Q1.3 | 43.9,21.46 C18.2
  Top 0.61: 3.94,18.29 v3.94,17.4 3.77,17.23 C29.1 | 3.94,18.29 3.94,18.8 3.17,19.56 2.4,19.56 C28.2 | C23.2 4.32,18.67 4,18.35 | 4,18.35 3.94,18.29 | U8.2 4.23,18.12 4,18.35
  Bottom 0.203: U9.VDD 6.22,22.22 6.16,22.16
  Bottom 0.254: 8.64,3.56 8.26,3.56
  Bottom 0.406: v17.27,3.94 17.91,3.94 20.19,1.52 27.18,1.52 28.7,1.52 v29.72,1.52 v30.86,1.52
  Bottom 0.457: 9.14,3.56 8.64,3.56 9.27,4.19 9.27,9.02 10.41,10.16 10.41,16.38 9.65,17.14 4.32,17.14 4.06,17.4 v3.94,17.4 6.16,19.62 6.16,22.16
  Bottom 0.508: 12.06,3.56 9.14,3.56 8.64,3.56 8.13,3.56 8.06,3.49 8,3.43 7.49,2.92 JP2.4 | 12.06,3.56 16.89,3.56 v17.27,3.94 | v12.7,4.06 12.06,3.56

### Text on the board
tPlace: 3Vin | Ant | 3Vin | gnd | 3Vin | rst | so | si | clk | 3v | gnd
bPlace: OpenHardware.io | Multisensors r1 / Scalz (c) 2016 | gnd | gnd | 3v | rx | tx | dtr | d3